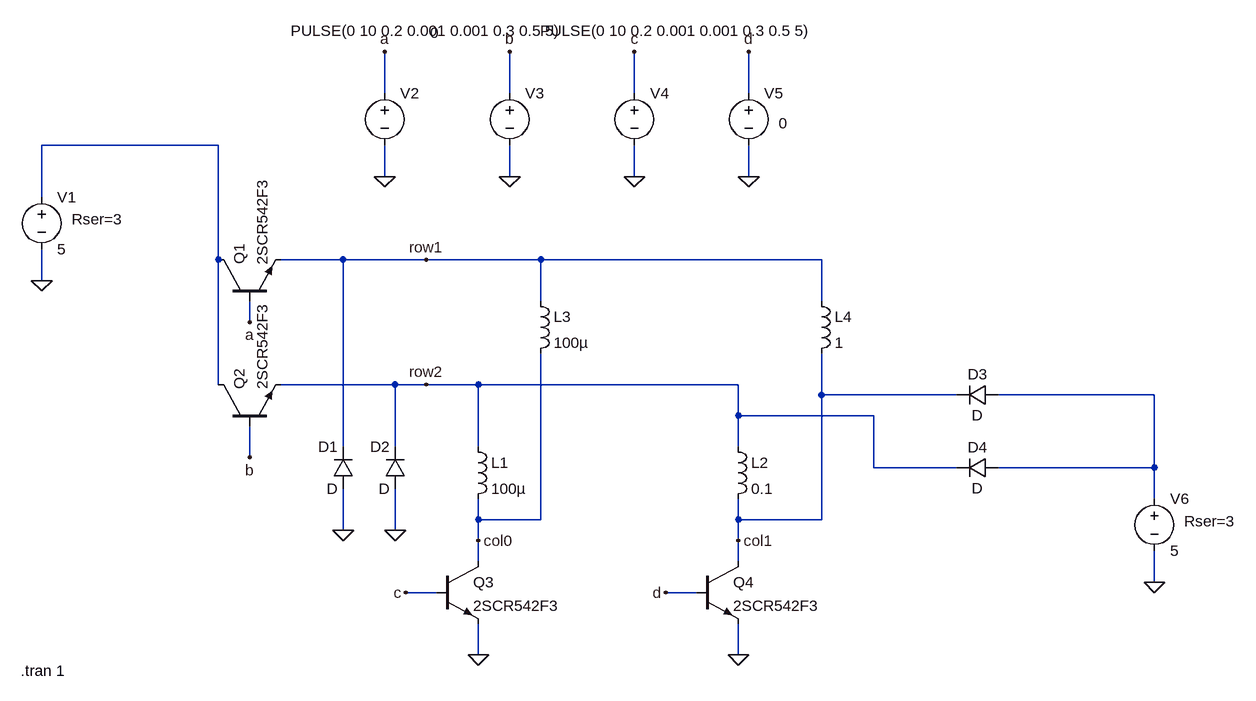
[diagram p0: schematic flyback_diodes.asc]
flyback_diodes.asc, the LTspice schematic file:
Version 4
SHEET 1 1624 680
WIRE 64 -656 64 -720
WIRE 256 -656 256 -720
WIRE 448 -656 448 -720
WIRE 624 -656 624 -720
WIRE -192 -576 -464 -576
WIRE 64 -528 64 -576
WIRE 256 -528 256 -576
WIRE 448 -528 448 -576
WIRE 624 -528 624 -576
WIRE -464 -496 -464 -576
WIRE -192 -400 -192 -576
WIRE 0 -400 -96 -400
WIRE 128 -400 0 -400
WIRE 304 -400 128 -400
WIRE 736 -400 304 -400
WIRE -464 -368 -464 -416
WIRE 304 -336 304 -400
WIRE 736 -336 736 -400
WIRE -144 -304 -144 -336
WIRE -192 -208 -192 -400
WIRE 80 -208 -96 -208
WIRE 128 -208 80 -208
WIRE 208 -208 128 -208
WIRE 608 -208 208 -208
WIRE 736 -192 736 -256
WIRE 944 -192 736 -192
WIRE 1248 -192 1008 -192
WIRE 608 -160 608 -208
WIRE 816 -160 608 -160
WIRE 0 -112 0 -400
WIRE 80 -112 80 -208
WIRE 208 -112 208 -208
WIRE 608 -112 608 -160
WIRE -144 -96 -144 -144
WIRE 816 -80 816 -160
WIRE 944 -80 816 -80
WIRE 1248 -80 1248 -192
WIRE 1248 -80 1008 -80
WIRE 1248 -32 1248 -80
WIRE 208 0 208 -32
WIRE 304 0 304 -256
WIRE 304 0 208 0
WIRE 608 0 608 -32
WIRE 736 0 736 -192
WIRE 736 0 608 0
WIRE 0 16 0 -48
WIRE 80 16 80 -48
WIRE 208 32 208 0
WIRE 608 32 608 0
WIRE 208 64 208 32
WIRE 608 64 608 32
WIRE 1248 96 1248 48
WIRE 144 112 96 112
WIRE 544 112 496 112
WIRE 208 208 208 160
WIRE 608 208 608 160
FLAG 208 208 0
FLAG 608 208 0
FLAG 208 32 col0
FLAG 608 32 col1
FLAG 128 -400 row1
FLAG 128 -208 row2
FLAG -144 -304 a
FLAG -144 -96 b
FLAG 96 112 c
FLAG 496 112 d
FLAG -464 -368 0
FLAG 64 -528 0
FLAG 256 -528 0
FLAG 448 -528 0
FLAG 624 -528 0
FLAG 64 -720 a
FLAG 256 -720 b
FLAG 448 -720 c
FLAG 624 -720 d
FLAG 0 16 0
FLAG 80 16 0
FLAG 1248 96 0
SYMBOL ind 192 -128 R0
SYMATTR InstName L1
SYMATTR Value 100µ
SYMATTR SpiceLine Ipk=3 Rser=5
SYMBOL ind 592 -128 R0
SYMATTR InstName L2
SYMATTR Value 0.1
SYMATTR SpiceLine Ipk=3 Rser=0.1
SYMBOL ind 288 -352 R0
SYMATTR InstName L3
SYMATTR Value 100µ
SYMATTR SpiceLine Ipk=0.069 Rser=5 Rpar=0 Cpar=0
SYMBOL ind 720 -352 R0
SYMATTR InstName L4
SYMATTR Value 1
SYMATTR SpiceLine Ipk=3 Rser=0.1
SYMBOL voltage -464 -512 R0
WINDOW 123 0 0 Left 0
WINDOW 39 46 50 Left 2
SYMATTR InstName V1
SYMATTR Value 5
SYMATTR SpiceLine Rser=3
SYMBOL voltage 64 -672 R0
WINDOW 3 -145 -80 Left 2
WINDOW 123 0 0 Left 0
WINDOW 39 0 0 Left 0
SYMATTR InstName V2
SYMATTR Value PULSE(0 10 0.2 0.001 0.001 0.3 0.5 5)
SYMBOL voltage 624 -672 R0
WINDOW 3 46 62 Left 2
WINDOW 123 0 0 Left 0
WINDOW 39 0 0 Left 0
SYMATTR InstName V5
SYMATTR Value 0
SYMBOL voltage 256 -672 R0
WINDOW 3 -122 -77 Left 2
WINDOW 123 0 0 Left 0
WINDOW 39 0 0 Left 0
SYMATTR InstName V3
SYMATTR Value 0
SYMBOL voltage 448 -672 R0
WINDOW 3 -145 -80 Left 2
WINDOW 123 0 0 Left 0
WINDOW 39 0 0 Left 0
SYMATTR InstName V4
SYMATTR Value PULSE(0 10 0.2 0.001 0.001 0.3 0.5 5)
SYMBOL npn -192 -336 R270
SYMATTR InstName Q1
SYMATTR Value 2SCR542F3
SYMBOL npn -192 -144 R270
SYMATTR InstName Q2
SYMATTR Value 2SCR542F3
SYMBOL npn 144 64 R0
SYMATTR InstName Q3
SYMATTR Value 2SCR542F3
SYMBOL npn 544 64 R0
SYMATTR InstName Q4
SYMATTR Value 2SCR542F3
SYMBOL diode 16 -48 R180
WINDOW 0 24 64 Left 2
WINDOW 3 24 0 Left 2
SYMATTR InstName D1
SYMBOL diode 96 -48 R180
WINDOW 0 24 64 Left 2
WINDOW 3 24 0 Left 2
SYMATTR InstName D2
SYMBOL diode 1008 -208 R90
WINDOW 0 0 32 VBottom 2
WINDOW 3 32 32 VTop 2
SYMATTR InstName D3
SYMBOL diode 1008 -96 R90
WINDOW 0 0 32 VBottom 2
WINDOW 3 32 32 VTop 2
SYMATTR InstName D4
SYMBOL voltage 1248 -48 R0
WINDOW 123 0 0 Left 0
WINDOW 39 46 50 Left 2
SYMATTR InstName V6
SYMATTR Value 5
SYMATTR SpiceLine Rser=3
TEXT -496 232 Left 2 !.tran 1

The netlist it stands for:
* flyback_diodes.asc
L1 row2 col0 100µ Ipk=3 Rser=5
L2 row2 col1 0.1 Ipk=3 Rser=0.1
L3 row1 col0 100µ Ipk=0.069 Rser=5 Rpar=0 Cpar=0
L4 row1 col1 1 Ipk=3 Rser=0.1
V1 N001 0 5 Rser=3
V2 a 0 PULSE(0 10 0.2 0.001 0.001 0.3 0.5 5)
V5 d 0 0
V3 b 0 0
V4 c 0 PULSE(0 10 0.2 0.001 0.001 0.3 0.5 5)
Q1 N001 a row1 0 2SCR542F3
Q2 N001 b row2 0 2SCR542F3
Q3 col0 c 0 0 2SCR542F3
Q4 col1 d 0 0 2SCR542F3
D1 0 row1 D
D2 0 row2 D
D3 N002 col1 D
D4 N002 row2 D
V6 N002 0 5 Rser=3
.model D D
.lib standard.dio
.model NPN NPN
.model PNP PNP
.lib standard.bjt
.tran 1
.backanno
.end